# Altium schematic sheet MinGo_V4.0.SchDoc
size A2
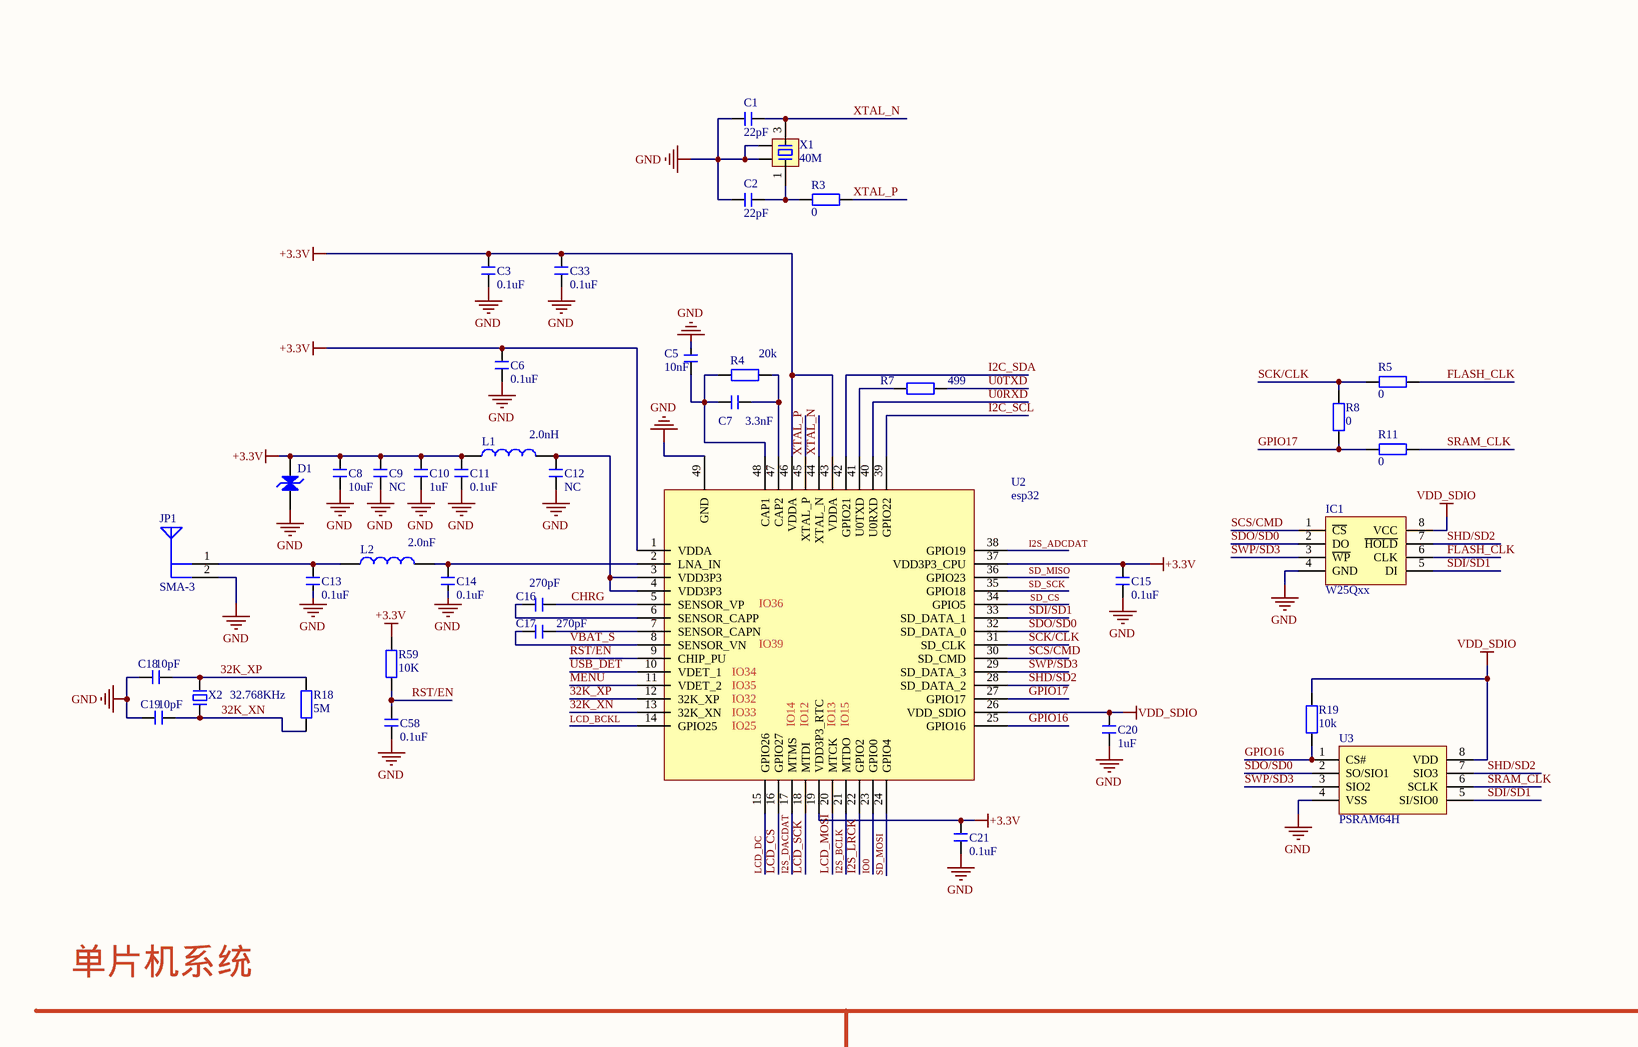
[diagram p0: MinGo_V4.0.SchDoc, top left]
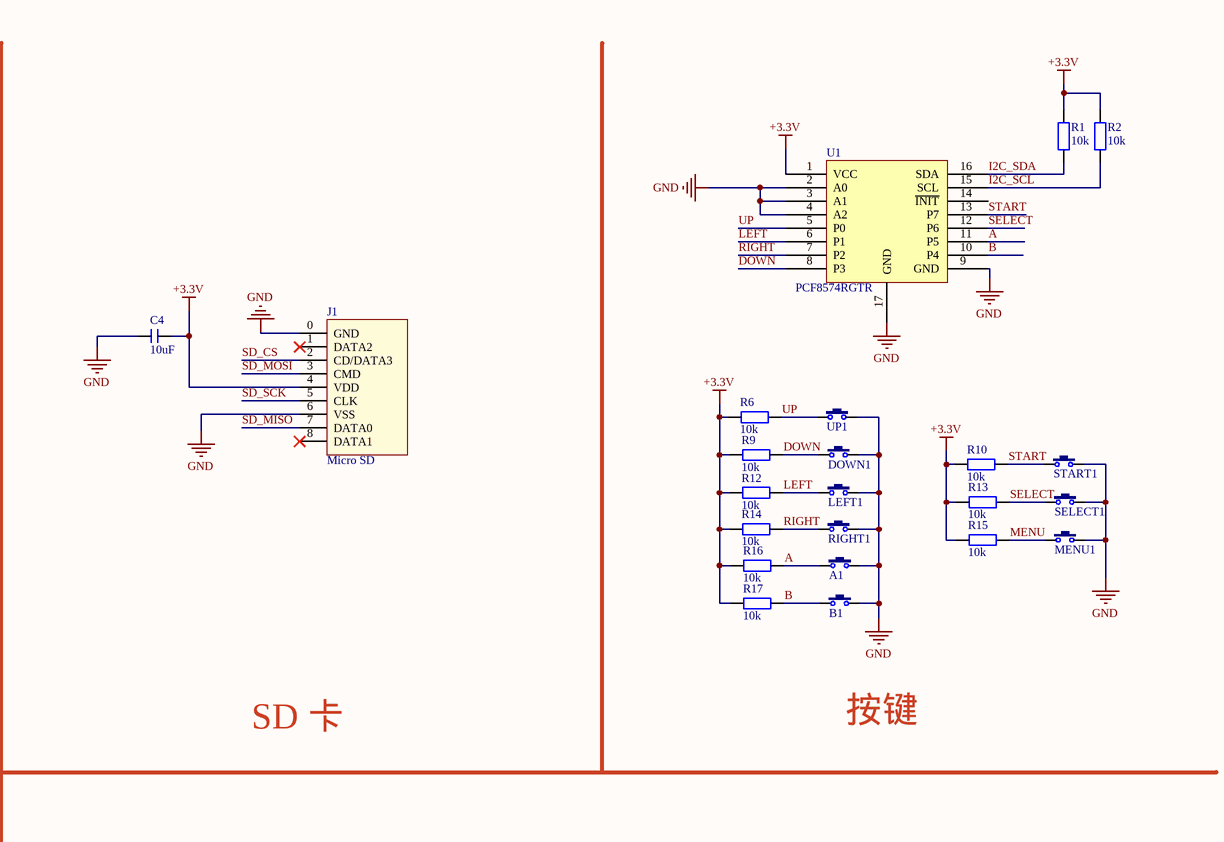
[diagram p1: MinGo_V4.0.SchDoc, top right]
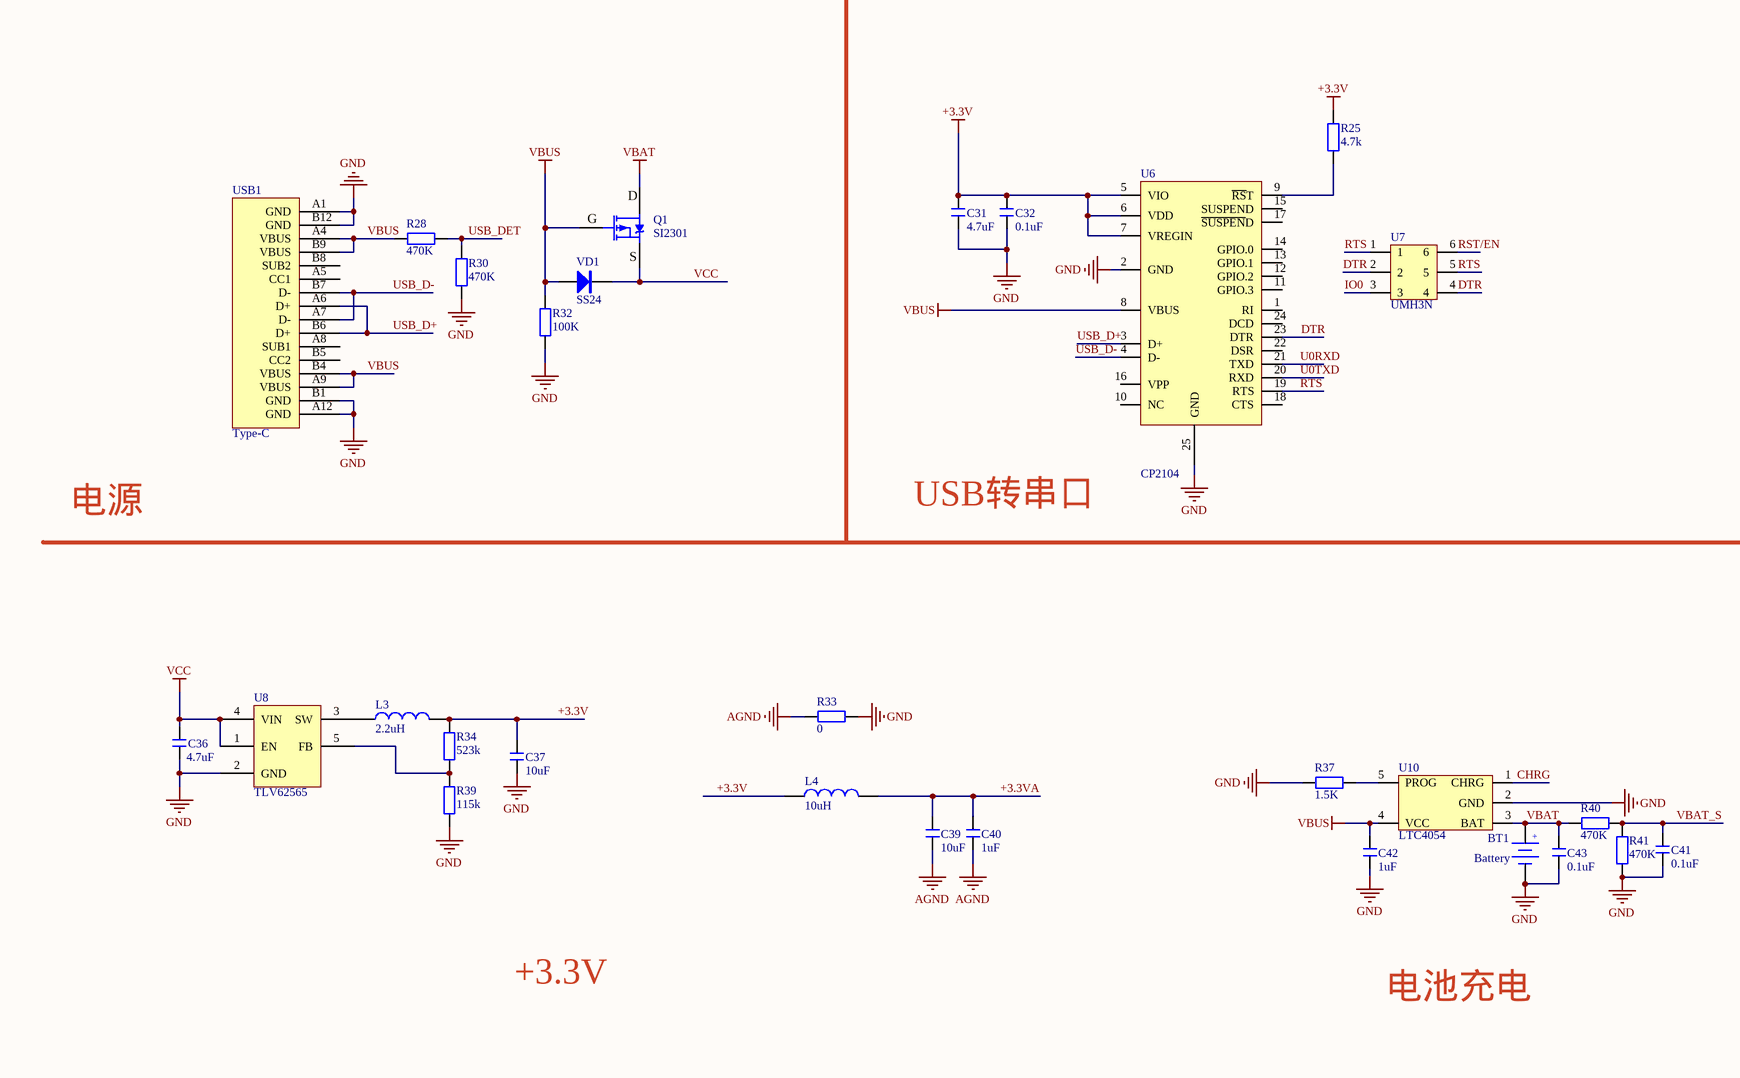
[diagram p2: MinGo_V4.0.SchDoc, bottom left]
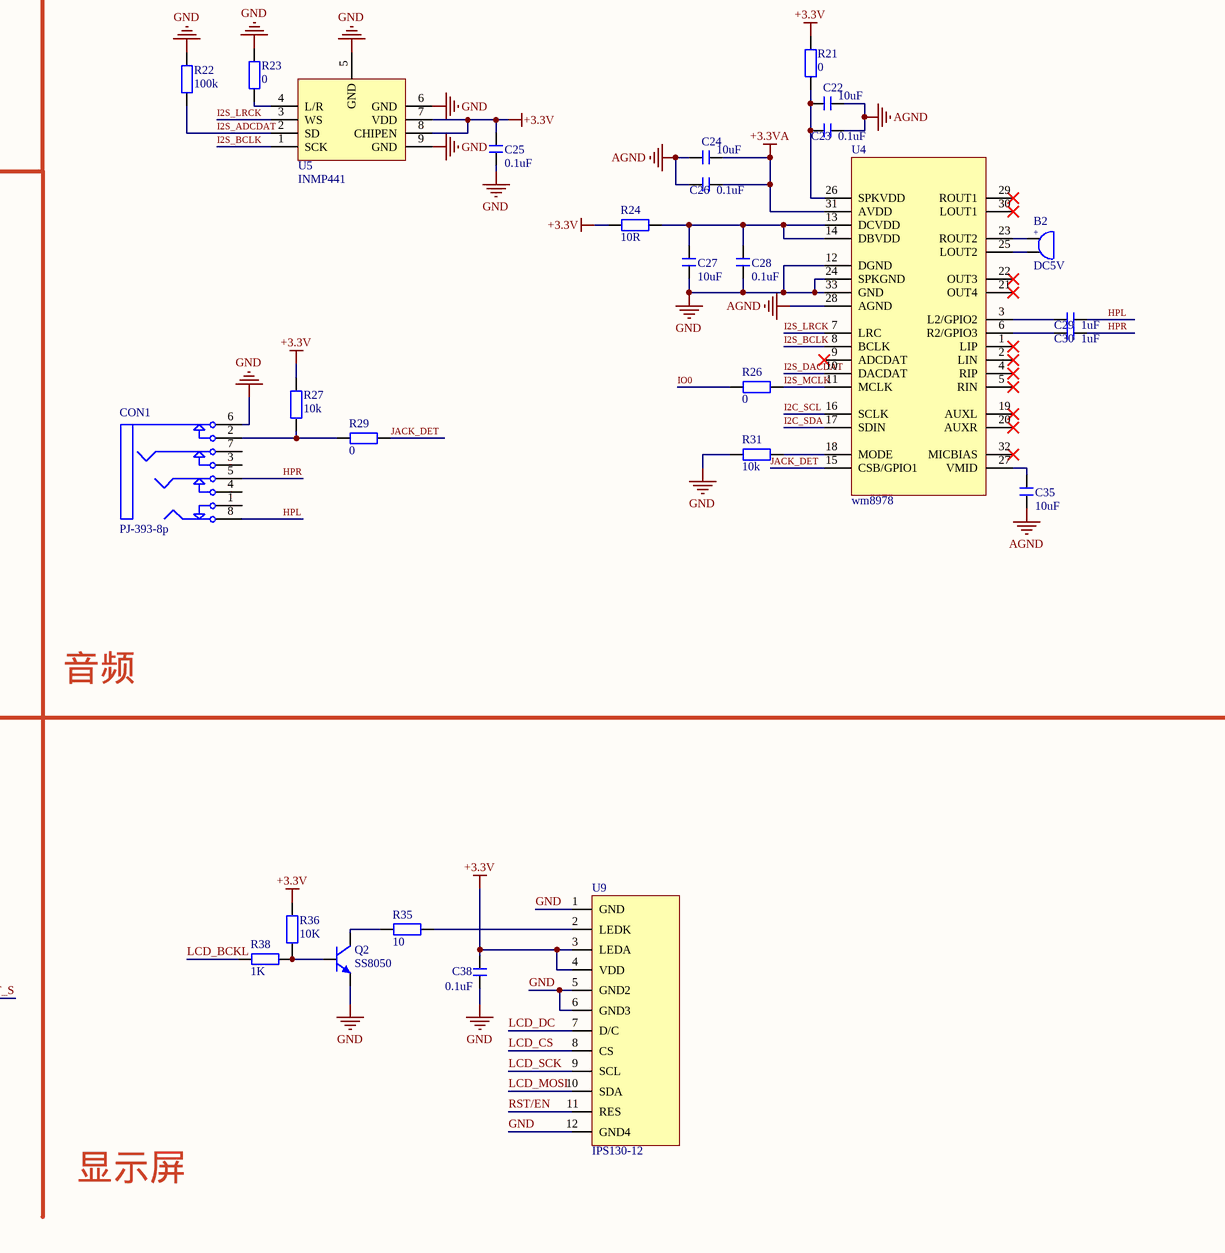
[diagram p3: MinGo_V4.0.SchDoc, bottom right]

## Parts
A1  SW SMD-2  [Touch key 3]  (value not drawn)
B1  SW SMD-2  [Touch key 3]  (value not drawn)
B2  DC5V  [BEEP SMD-2]
BT1  Battery  [Li-Bettery SMD]
C1  22pF  [C 0402]
C2  22pF  [C 0402]
C3  0.1uF  [C 0402]
C4  10uF  [C 0603]
C5  10nF  [C 0402]
C6  0.1uF  [C 0402]
C7  3.3nF  [C 0402]
C8  10uF  [C 0603]
C9  NC  [C 0402]
C10  1uF  [C 0402]
C11  0.1uF  [C 0402]
C12  NC  [C 0402]
C13  0.1uF  [C 0402]
C14  0.1uF  [C 0402]
C15  0.1uF  [C 0402]
C16  270pF  [C 0402]
C17  270pF  [C 0402]
C18  10pF  [C 0402]
C19  10pF  [C 0402]
C20  1uF  [C 0402]
C21  0.1uF  [C 0402]
C22  10uF  [C 0603]
C23  0.1uF  [C 0402]
C24  10uF  [C 0603]
C25  0.1uF  [C 0402]
C26  0.1uF  [C 0402]
C27  10uF  [C 0603]
C28  0.1uF  [C 0402]
C29  1uF  [C 0603]
C30  1uF  [C 0603]
C31  4.7uF  [C 0603]
C32  0.1uF  [C 0402]
C33  0.1uF  [C 0402]
C35  10uF  [C 0603]
C36  4.7uF  [C 0805]
C37  10uF  [C 0805]
C38  0.1uF  [C 0402]
C39  10uF  [C 0603]
C40  1uF  [C 0603]
C41  0.1uF  [C 0402]
C42  1uF  [C 0603]
C43  0.1uF  [C 0402]
C58  0.1uF  [C 0603]
CON1  PJ-393-8p  [PJ393-8p]
D1  (no value)  [SOD-323]
DOWN1  SW SMD-2  [Touch key 3]  (value not drawn)
IC1  W25Qxx  [SOP8W_N]
J1  Micro SD  [MY SD CARD]
JP1  SMA-3  [2.4GANTS10]
L1  2.0nH  [L 0402]
L2  2.0nF  [L 0402]
L3  2.2uH  [3015]
L4  10uH  [L 1206]
LEFT1  SW SMD-2  [Touch key 3]  (value not drawn)
MENU1  SW SMD-2  [SW SMD-4.8*4.8*0.5]  (value not drawn)
Q1  SI2301  [SOT23-3N]
Q2  SS8050  [SOT23-3M]
R1  10k  [R 0402]
R2  10k  [R 0402]
R3  0  [R 0402]
R4  20k  [R 0402]
R5  0  [R 0402]
R6  10k  [R 0402]
R7  499  [R 0402]
R8  0  [R 0402]
R9  10k  [R 0402]
R10  10k  [R 0402]
R11  0  [R 0402]
R12  10k  [R 0402]
R13  10k  [R 0402]
R14  10k  [R 0402]
R15  10k  [R 0402]
R16  10k  [R 0402]
R17  10k  [R 0402]
R18  5M  [R 0402]
R19  10k  [R 0402]
R21  0  [R 0603]
R22  100k  [R 0402]
R23  0  [R 0402]
R24  10R  [R 0603]
R25  4.7k  [R 0402]
R26  0  [R 0402]
R27  10k  [R 0402]
R28  470K  [R 0603]
R29  0  [R 0402]
R30  470K  [R 0603]
R31  10k  [R 0402]
R32  100K  [R 0402]
R33  0  [R 0603]
R34  523k  [R 0402]
R35  10  [R 0402]
R36  10K  [R 0402]
R37  1.5K  [R 0402]
R38  1K  [R 0402]
R39  115k  [R 0402]
R40  470K  [R 0402]
R41  470K  [R 0402]
R59  10K  [R 0402]
RIGHT1  SW SMD-2  [Touch key 3]  (value not drawn)
SELECT1  SW SMD-2  [SW SMD-4.8*4.8*0.5]  (value not drawn)
START1  SW SMD-2  [SW SMD-4.8*4.8*0.5]  (value not drawn)
U1  PCF8574RGTR  [QFN16]
U2  esp32  [QFN48A]
U3  PSRAM64H  [SOIC8]
U4  wm8978  [QFN32 5x5_M]
U5  INMP441  [INMP441]
U6  CP2104  [QFN24]
U7  UMH3N  [SOT336]
U8  TLV62565  [SOT23-5N]
U9  IPS130-12  [ips154]
U10  LTC4054  [SOT23-5M]
UP1  SW SMD-2  [Touch key 3]  (value not drawn)
USB1  Type-C  [type C 16p]
VD1  SS24  [SOD-123]
X1  40M  [XTAL-3225]
X2  32.768KHz  [XTAL-3215]

## Nets
+3.3V: C3.2 C4.1 C6.2 C8.2 C9.2 C10.2 C11.2 C15.2 C21.2 C25.2 C31.2 C32.2 C33.2 C37.2 C38.2 D1.1(A) J1.4(VDD) L1.1 L3.2 L4.1 R1.1 R2.1 R6.2 R9.2 R10.2 R12.2 R13.2 R14.2 R15.2 R16.2 R17.2 R21.1 R24.1 R25.2 R27.1 R34.1 R36.1 R59.1 U1.1(VCC) U2.1(VDDA) U2.19(VDD3P3_RTC) U2.37(VDD3P3_CPU) U2.43(VDDA) U2.46(VDDA) U5.7(VDD) U5.8(CHIPEN) U6.5(VIO) U6.6(VDD) U6.7(VREGIN) U9.3(LEDA) U9.4(VDD)
+3.3VA: C24.2 C26.2 C39.2 C40.2 L4.2 U4.31(AVDD)
AGND: C22.2 C23.2 C24.1 C26.1 C35.1 C39.1 C40.1 R33.2 U4.28(AGND)
GND: A1.2 B1.2 BT1.2 C1.2 C2.2 C3.1 C4.2 C5.1 C6.1 C8.1 C9.1 C10.1 C11.1 C12.1 C13.1 C14.1 C15.1 C18.1 C19.1 C20.1 C21.1 C25.1 C27.1 C28.1 C31.1 C32.1 C33.1 C36.1 C37.1 C38.1 C41.1 C42.1 C43.1 C58.1 CON1.6 D1.2(K) DOWN1.2 IC1.4(GND) J1.0(GND) J1.6(VSS) JP1.2(ANT) LEFT1.2 MENU1.2 Q2.2(E) R22.2 R23.2 R30.2 R31.1 R32.1 R33.1 R37.2 R39.1 R41.2 RIGHT1.2 SELECT1.2 START1.2 U1.2(A0) U1.3(A1) U1.4(A2) U1.9(GND) U1.17(GND) U2.49(GND) U3.4(VSS) U4.12(DGND) U4.24(SPKGND) U4.33(GND) U5.5(GND) U5.6(GND) U5.9(GND) U6.2(GND) U6.25(GND) U8.2(GND) U9.1(GND) U9.5(GND2) U9.6(GND3) U9.12(GND4) U10.2(GND) UP1.2 USB1.A1(GND) USB1.A12(GND) USB1.B1(GND) USB1.B12(GND) X1.2 X1.4
VBAT: BT1.1 C43.2 Q1.3(D) R40.1 U10.3(BAT)
VBUS: C42.2 Q1.1(G) R28.1 R32.2 U6.8(VBUS) U10.4(VCC) USB1.A4(VBUS) USB1.A9(VBUS) USB1.B4(VBUS) USB1.B9(VBUS) VD1.1(A)
VCC: C36.2 Q1.2(S) U8.1(EN) U8.4(VIN) VD1.2(K)
VDD_SDIO: C20.2 IC1.8(VCC) R19.2 U2.26(VDD_SDIO) U3.8(VDD)
32K_XN: C19.2 R18.1 U2.13(32K_XN) X2.1
32K_XP: C18.2 R18.2 U2.12(32K_XP) X2.2
A: A1.1 R16.1 U1.11(P5)
B: B1.1 R17.1 U1.10(P4)
CHRG: C16.1 U2.5(SENSOR_VP) U10.1(CHRG)
DOWN: DOWN1.1 R9.1 U1.8(P3)
DTR: U6.23(DTR) U7.2 U7.4
FLASH_CLK: IC1.6(CLK) R5.2
GPIO16: R19.1 U2.25(GPIO16) U3.1(CS#)
GPIO17: R8.1 R11.1 U2.27(GPIO17)
HPL: C29.2 CON1.8
HPR: C30.2 CON1.5
I2C_SCL: R2.2 U1.15(SCL) U2.39(GPIO22) U4.16(SCLK)
I2C_SDA: R1.2 U1.16(SDA) U2.42(GPIO21) U4.17(SDIN)
I2S_ADCDAT: R22.1 U2.38(GPIO19) U5.2(SD)
I2S_BCLK: U2.21(MTDO) U4.8(BCLK) U5.1(SCK)
I2S_DACDAT: U2.17(MTMS) U4.10(DACDAT)
I2S_LRCK: U2.22(GPIO2) U4.7(LRC) U5.3(WS)
I2S_MCLK: R26.2 U4.11(MCLK)
IO0: R26.1 U2.23(GPIO0) U7.3
JACK_DET: R29.2 U4.15(CSB/GPIO1)
LCD_BCKL: R38.1 U2.14(GPIO25)
LCD_CS: U2.16(GPIO27) U9.8(CS)
LCD_DC: U2.15(GPIO26) U9.7(D/C)
LCD_MOSI: U2.20(MTCK) U9.10(SDA)
LCD_SCK: U2.18(MTDI) U9.9(SCL)
LEFT: LEFT1.1 R12.1 U1.6(P1)
MENU: MENU1.1 R15.1 U2.11(VDET_2)
RIGHT: R14.1 RIGHT1.1 U1.7(P2)
RST/EN: C58.2 R59.2 U2.9(CHIP_PU) U7.6 U9.11(RES)
RTS: U6.19(RTS) U7.1 U7.5
SCK/CLK: R5.1 R8.2 U2.31(SD_CLK)
SCS/CMD: IC1.1(~{CS}) U2.30(SD_CMD)
SD_CS: J1.2(CD/DATA3) U2.34(GPIO5)
SD_MISO: J1.7(DATA0) U2.36(GPIO23)
SD_MOSI: J1.3(CMD) U2.24(GPIO4)
SD_SCK: J1.5(CLK) U2.35(GPIO18)
SDI/SD1: IC1.5(DI) U2.33(SD_DATA_1) U3.5(SI/SIO0)
SDO/SD0: IC1.2(DO) U2.32(SD_DATA_0) U3.2(SO/SIO1)
SELECT: R13.1 SELECT1.1 U1.12(P6)
SHD/SD2: IC1.7(~{HOLD}) U2.28(SD_DATA_2) U3.7(SIO3)
SRAM_CLK: R11.2 U3.6(SCLK)
START: R10.1 START1.1 U1.13(P7)
SWP/SD3: IC1.3(~{WP}) U2.29(SD_DATA_3) U3.3(SIO2)
U0RXD: U2.40(U0RXD) U6.21(TXD)
U0TXD: R7.2 U6.20(RXD)
UP: R6.1 U1.5(P0) UP1.1
USB_D+: U6.3(D+) USB1.A6(D+) USB1.B6(D+)
USB_D-: U6.4(D-) USB1.A7(D-) USB1.B7(D-)
USB_DET: R28.2 R30.1 U2.10(VDET_1)
VBAT_S: C17.2 C41.2 R40.2 R41.1 U2.8(SENSOR_VN)
XTAL_N: C1.1 U2.44(XTAL_N) X1.3
XTAL_P: R3.1 U2.45(XTAL_P)
NetB2_1: B2.1 U4.23(ROUT2)
NetB2_2: B2.2 U4.25(LOUT2)
NetC2_1: C2.1 R3.2 X1.1
NetC5_2: C5.2 C7.2 R4.2 U2.48(CAP1)
NetC7_1: C7.1 R4.1 U2.47(CAP2)
NetC12_2: C12.2 L1.2 U2.3(VDD3P3) U2.4(VDD3P3)
NetC13_2: C13.2 JP1.1(ANT) L2.1
NetC14_2: C14.2 L2.2 U2.2(LNA_IN)
NetC16_2: C16.2 U2.6(SENSOR_CAPP)
NetC17_1: C17.1 U2.7(SENSOR_CAPN)
NetC22_1: C22.1 C23.1 R21.2 U4.26(SPKVDD)
NetC27_2: C27.2 C28.2 R24.2 U4.13(DCVDD) U4.14(DBVDD)
NetC29_1: C29.1 U4.3(L2/GPIO2)
NetC30_1: C30.1 U4.6(R2/GPIO3)
NetC35_2: C35.2 U4.27(VMID)
NetCON1_2: CON1.2 R27.2 R29.1
NetL3_1: L3.1 U8.3(SW)
NetQ2_1: Q2.1(B) R36.2 R38.2
NetQ2_3: Q2.3(C) R35.1
NetR7_1: R7.1 U2.41(U0TXD)
NetR23_1: R23.1 U5.4(L/R)
NetR25_1: R25.1 U6.9(~{RS}T)
NetR31_2: R31.2 U4.18(MODE)
NetR34_2: R34.2 R39.2 U8.5(FB)
NetR35_2: R35.2 U9.2(LEDK)
NetR37_1: R37.1 U10.5(PROG)

Not connected (* = marked no-connect by the designer): CON1 1 3 4 7; J1 1(DATA2)* 8(DATA1)*; U1 14(~{INIT}); U4 1(LIP)* 2(LIN)* 4(RIP)* 5(RIN)* 9(ADCDAT)* 19(AUXL)* 20(AUXR)* 21(OUT4)* 22(OUT3)* 29(ROUT1)* 30(LOUT1)* 32(MICBIAS)*; U6 1(RI) 10(NC) 11(GPIO.3) 12(GPIO.2) 13(GPIO.1) 14(GPIO.0) 15(SUSPEND) 16(VPP) 17(~{SUSPEN}D) 18(CTS) 22(DSR) 24(DCD); USB1 A5(CC1) A8(SUB1) B5(CC2) B8(SUB2)

## Notes on the sheet
- (near U2) IO36
- (near U2) IO34
- (near U2) IO35
- (near U2) IO39
- 按键
- (near U2) IO33
- (near U2) IO32
- (near U2) IO25
- (near U2) IO14
- (near U2) IO12
- (near U2) IO13
- (near U2) IO15
- SD 卡
- 单片机系统
- 电源
- USB转串口
- 音频
- +3.3V
- 电池充电
- 显示屏
- (in symbol Battery) +
- (in symbol BEEP) +

## Library data of the parts
A1 B1 DOWN1 LEFT1 MENU1 RIGHT1 SELECT1 START1 UP1 = SW SMD-2: Arduboy 用
B2 = BEEP: 蜂鸣器; 版权归属: 黎明电子style; BOM名称: 蜂鸣器; 学习资源: https://lmdzstyle.taobao.com/
BT1 = Battery: 锂电池
C1-C33 C35-C43 C58 = C: 无极性贴片电容; 版权归属: 黎明电子style; BOM名称: 无极性贴片电容; 学习资源: https://lmdzstyle.taobao.com/
D1 = DR: 瞬态电压抑制二极管; 版权归属: 黎明电子style; BOM名称: 瞬态电压抑制二极管; 学习资源: https://lmdzstyle.taobao.com/
IC1 = W25Qxx: 外置Flash; 版权归属: 黎明电子style; BOM名称: 外置Flash; 学习资源: https://lmdzstyle.taobao.com/
J1 = Micro SD: Micro SD卡; 版权归属: 黎明电子style; BOM名称: Micro SD卡; 学习资源: https://lmdzstyle.taobao.com/
JP1 = SMA-3: SMA-板载2.4G射频天线; 版权归属: 黎明电子style; BOM名称: 板载2.4G射频天线; 学习资源: https://lmdzstyle.taobao.com/
L1-L4 = L: 小功率贴片电感; 版权归属: 黎明电子style; BOM名称: 小功率贴片电感; 学习资源: https://lmdzstyle.taobao.com/
Q1 = SI2301: P沟道场效应管; 版权归属: 黎明电子style; BOM名称: P沟道场效应管; 学习资源: https://lmdzstyle.taobao.com/
Q2 = 8050-SMD: 高频放大-NPN型; 版权归属: 黎明电子style; 属性: 40V 1.5A 1W 100MHZ; BOM名称: 高频放大-NPN型; 学习资源: https://lmdzstyle.taobao.com/
R1-R19 R21-R41 R59 = R: 贴片电阻; 版权归属: 黎明电子style; BOM名称: 贴片电阻; 学习资源: https://lmdzstyle.taobao.com/
U1 = PCF8574RGTR: TI 8位 IO扩展芯片
U2 = esp32: esp32 芯片
U3 = PSRAM64H: PSRAM
U6 = CP2104: USB转串口芯片
U7 = UMH3N: 三极管(阵列)，内置电阻，自动下载电路用
U8 = TLV62565: TI TLV62565DBVR 电源管理芯片
U10 = LTC4054: 充电管理
USB1 = Type-C Socket: USB 3.1  单排16PIN四脚插板(L=7.35) 一体式MD; ComponentLink1Description: USB 3.1 C TYPE单排16PIN四脚插板(L=7.35) 一体式MD; ComponentLink1URL: https://item.szlcsc.com/293008.html
VD1 = SS24: 肖特基二极管; 版权归属: 黎明电子style; 属性: 40V/2A; BOM名称: 肖特基二极管; 学习资源: https://lmdzstyle.taobao.com/
X1 = XTAL-4: 4脚晶振; 版权归属: 黎明电子style; BOM名称: 4脚晶振; 学习资源: https://lmdzstyle.taobao.com/
X2 = XTAL-2: 2脚晶振; 版权归属: 黎明电子style; BOM名称: 2脚晶振; 学习资源: https://lmdzstyle.taobao.com/